# Altium project secret-25.PrjPcb
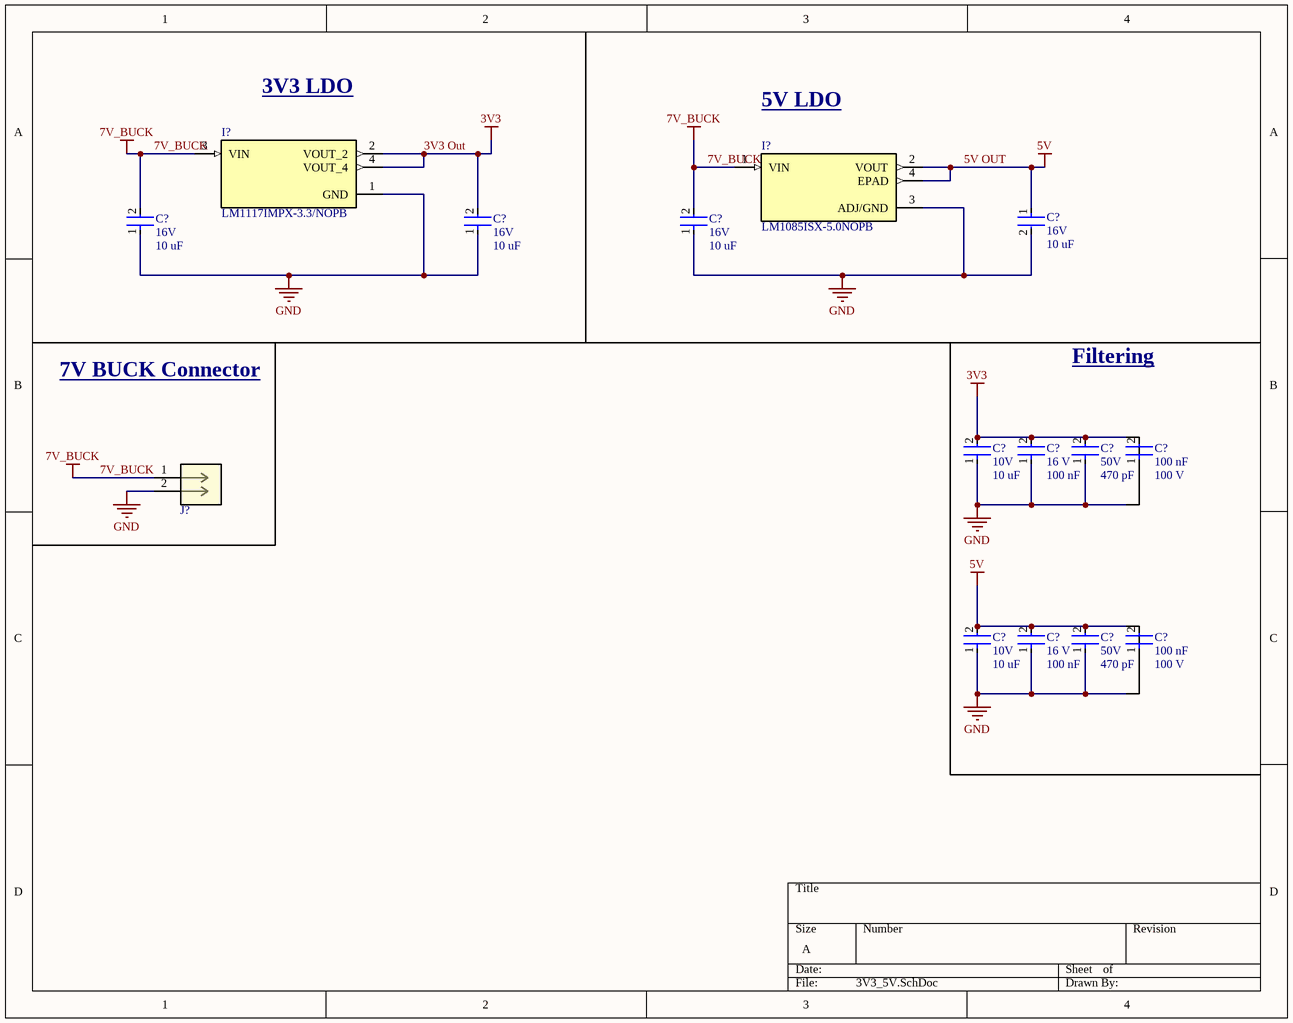
[diagram p0: 3V3_5V.SchDoc]
4 sheets, 44 parts. Net scope: flat (ports and power ports of the same name join across sheets).
Sheets:
  3V3_5V.SchDoc
  CAN.SchDoc
  Input_power.SchDoc
  MCU.SchDoc

## Sheet 3V3_5V.SchDoc
size A; SheetNumber: 1; SheetTotal: 4

### Parts
(Parts that share a designator on the sheet are numbered #1, #2 ... from top to bottom, then left to right.)
C?#1  Voltage: 16V  Capacitance: 10 uF  [CAP-1206]  (hidden comment: 293D106X9016A2TE3)
C?#2  Voltage: 16V  Capacitance: 10 uF  [CAP-1206]  (hidden comment: 293D106X9016A2TE3)
C?#3  Voltage: 16V  Capacitance: 10 uF  [CAP-1206]  (hidden comment: 293D106X9016A2TE3)
C?#4  Voltage: 16V  Capacitance: 10 uF  [CAP-1206]  (hidden comment: 293D106X9016A2TE3)
C?#5  Voltage: 10V  Capacitance: 10 uF  [CAP-0603]  (hidden comment: CC0603KRX5R6BB106)
C?#6  Voltage Rating: 16 V  Capacitance: 100 nF  [CAP-0402]  (hidden comment: CC0402KRX7R7BB104)
C?#7  Voltage: 50V  Capacitance: 470 pF  [CAP-0805]  (hidden comment: CC0805JRNPO9BN471)
C?#8  Capacitance: 100 nF  Voltage: 100 V  [CAP-0603]  (hidden comment: CC0603KRX7R0BB104)
C?#9  Voltage: 10V  Capacitance: 10 uF  [CAP-0603]  (hidden comment: CC0603KRX5R6BB106)
C?#10  Voltage Rating: 16 V  Capacitance: 100 nF  [CAP-0402]  (hidden comment: CC0402KRX7R7BB104)
C?#11  Voltage: 50V  Capacitance: 470 pF  [CAP-0805]  (hidden comment: CC0805JRNPO9BN471)
C?#12  Capacitance: 100 nF  Voltage: 100 V  [CAP-0603]  (hidden comment: CC0603KRX7R0BB104)
I?#1  LM1117IMPX-3.3/NOPB  [IC-SOT-223-4]
I?#2  LM1085ISX-5.0NOPB  [IC-TO-263-4]
J?  0430450212  [CON_430450212_MOL]  (value not drawn)

### Nets
3V3 Out: C?#3.2 C?#5.2 C?#6.2 C?#7.2 I?#1.2(VOUT_2) I?#1.4(VOUT_4)  [also labelled 3V3]
5V OUT: C?#1.1 C?#9.2 C?#10.2 C?#11.2 I?#2.2(VOUT) I?#2.4(EPAD)  [also labelled 5V]
7V_BUCK: C?#2.2 C?#4.2 I?#1.3(VIN) I?#2.1(VIN) J?.1
GND: C?#1.2 C?#2.1 C?#3.1 C?#4.1 C?#5.1 C?#6.1 C?#7.1 C?#9.1 C?#10.1 C?#11.1 I?#1.1(GND) I?#2.3(ADJ/GND) J?.2

Not connected (* = marked no-connect by the designer): C?#8 1 2; C?#12 1 2

### Notes on the sheet
- 3V3 LDO
- 5V LDO
- Filtering
- 7V BUCK Connector

### Library data of the parts
C?#1-C?#4 = CAP-10U-0004: CAP TANT 10UF 10% 16V 1206; Device Class: Tantalum; Size: 1206; ComponentLink1Description: Datasheet; ComponentLink1URL: https://www.lcsc.com/datasheet/lcsc_datasheet_2304140030_Vishay-Intertech-293D106X9016A2TE3_C110038.pdf
C?#5 C?#9 = CAP-10U-0001: CAP CER 10UF 10V X5R 0603; ComponentLink1Description: Datasheet; ComponentLink1URL: https://www.yageo.com/upload/media/product/app/datasheet/mlcc/upy-gphc_x5r_4v-to-50v.pdf; Device Class: Ceramic; Size: 0603
C?#6 C?#10 = CAP-0.1U-0001: CAP CER 0.1UF 16V X7R 0402; ComponentLink2Description: Datasheet; ComponentLink2URL: https://www.yageo.com/upload/media/product/productsearch/datasheet/mlcc/UPY-GPHC_X7R_6.3V-to-250V_24.pdf; Device Class: Ceramic; Size: 0402
C?#7 C?#11 = CAP-470P-0001: CAP CER 470PF 50V C0G/NPO 0805; Device Class: Ceramic; Size: 0805; ComponentLink1Description: Datasheet; ComponentLink1URL: https://www.yageo.com/upload/media/product/productsearch/datasheet/mlcc/UPY-GP_NP0_16V-to-50V_18.pdf
C?#8 C?#12 = CAP-100N-0001: CAP CER 0.1UF 100V X7R 0603; Device Class: Ceramic; Size: 0603; ComponentLink1Description: Datasheet; ComponentLink1URL: https://www.yageo.com/upload/media/product/app/datasheet/mlcc/upy-np0x7r_mv_100-to-630v.pdf
I?#1 = IC_LDO_3V3_0001: IC REG LIN 3.3V 800MA SOT223-4; ComponentLink1Description: New link; ComponentLink1URL: https://www.ti.com/lit/ds/symlink/lm1117.pdf?HQS=dis-dk-null-digikeymode-dsf-pf-null-wwe&ts=1721700739746
I?#2 = IC_LDO_5V_0002: IC REG LIN 5V 3A DDPAK/TO263-3; Mfr_Name: Texas Instruments; RefDes: RefDes; Type: Type; ComponentLink1Description: Datasheet; ComponentLink1URL: https://www.ti.com/lit/ds/symlink/lm1085.pdf?HQS=dis-dk-null-digikeymode-dsf-pf-null-wwe&ts=1729859809163&ref_url=https%253A%252F%252Fwww.ti.com%252Fgeneral%252Fdocs%252Fsuppproductinfo.tsp%253FdistId%253D10%2526gotoUrl%253Dhttps%253A%252F%252Fwww.ti.com%252Flit%252Fgpn%252Flm1085
J? = CONN-2POS-0001: Connector Header Through Hole 2 position; Mfr_Name: Molex Connector Corporation; RefDes: RefDes; Type: Type

## Sheet CAN.SchDoc
size A; SheetNumber: 3; SheetTotal: 6
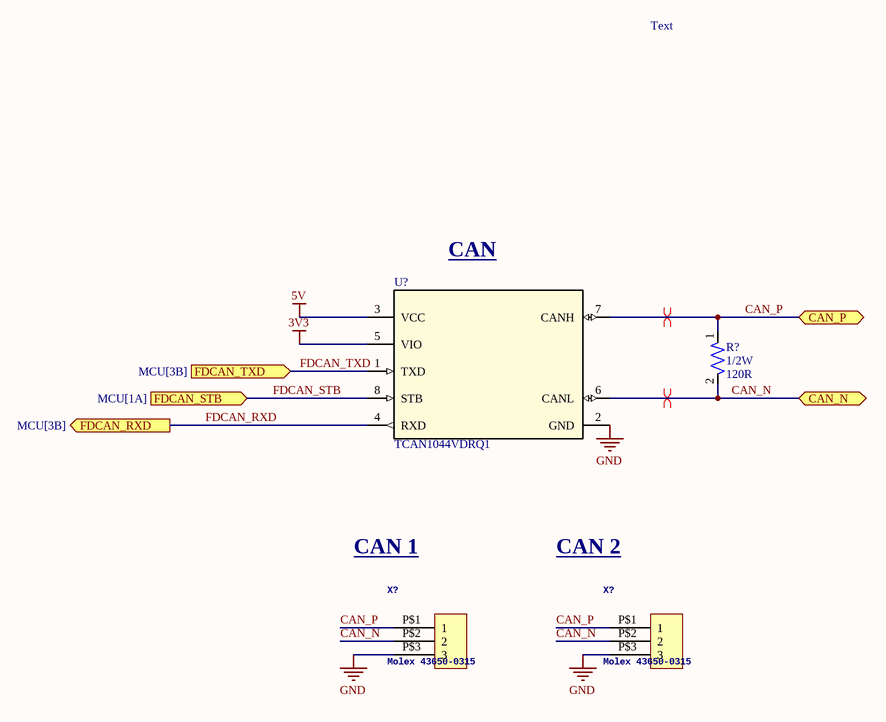
[diagram p1: CAN.SchDoc]

### Parts
(Parts that share a designator on the sheet are numbered #1, #2 ... from top to bottom, then left to right.)
R?  Power: 1/2W  Resistance: 120R  [RES-1210]  (hidden comment: RC1210FR-07120RL)
U?#1  TCAN1044VDRQ1  [IC-8SOIC]
X?#1  Molex 43650-0315  [43650-0315]
X?#2  Molex 43650-0315  [43650-0315]

### Ports
CAN_N (bidir), CAN_P (bidir), FDCAN_RXD (out, see MCU[3B]), FDCAN_STB (in, see MCU[1A]), FDCAN_TXD (in, see MCU[3B])

### Nets
3V3: U?#1.5(VIO)  [project net 3V3 Out]
5V: U?#1.3(VCC)  [project net 5V OUT]
GND: U?#1.2(GND) X?#1.P$3(3) X?#2.P$3(3)
CAN_N: R?.2 U?#1.6(CANL) X?#1.P$2(2) X?#2.P$2(2) ; port CAN_N
CAN_P: R?.1 U?#1.7(CANH) X?#1.P$1(1) X?#2.P$1(1) ; port CAN_P
FDCAN_RXD: U?#1.4(RXD) ; port FDCAN_RXD
FDCAN_STB: U?#1.8(STB) ; port FDCAN_STB
FDCAN_TXD: U?#1.1(TXD) ; port FDCAN_TXD

### Layout directives
differential pair: CAN_N, CAN_P

### Notes on the sheet
- Text
- CAN
- CAN 1
- CAN 2

### Library data of the parts
R? = RES-120-0001: RES 120 OHM 1% 1/2W 1210; Tolerance: 1%; Size: 1210; ComponentLink1Description: Datasheet; ComponentLink1URL: https://www.yageo.com/upload/media/product/products/datasheet/rchip/PYu-RC_Group_51_RoHS_L_12.pdf
U?#1 = IC-CAN-0001: IC TRANSCEIVER 1/1 8SOIC; ComponentLink1Description: Datasheet; ComponentLink1URL: https://www.ti.com/lit/ds/symlink/tcan1044-q1.pdf?HQS=dis-dk-null-digikeymode-dsf-pf-null-wwe&ts=1728758303289&ref_url=https%253A%252F%252Fwww.ti.com%252Fgeneral%252Fdocs%252Fsuppproductinfo.tsp%253FdistId%253D10%2526gotoUrl%253Dhttps%253A%252F%252Fwww.ti.com%252Flit%252Fgpn%252Ftcan1044-q1
X?#1 X?#2 = Micro-Fit Molex 3 Pin Vertical: GateName_1: G$1; SymbolName_1: HEADER_POS3; DeviceSetName: HEADER_POS3_?; DeviceName: 43650-0315; LibraryName: con-molex-micro-fit-3_0_2; Package: 43650-0315

## Sheet Input_power.SchDoc
size A; SheetNumber: 4; SheetTotal: 5
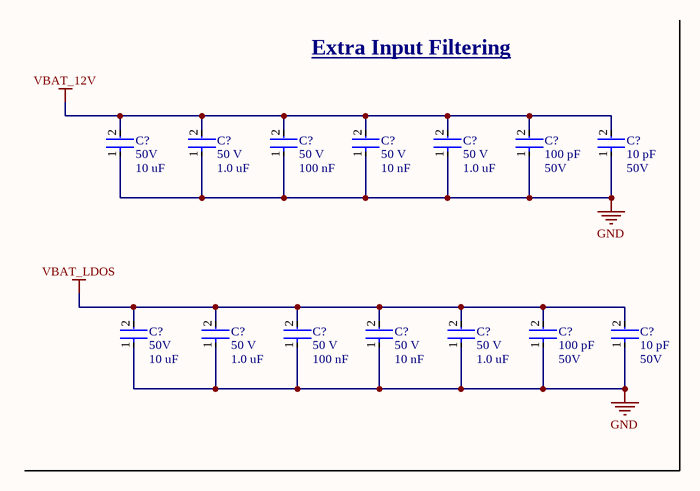
[diagram p2: Input_power.SchDoc]

### Parts
(Parts that share a designator on the sheet are numbered #1, #2 ... from top to bottom, then left to right.)
C?#13  Voltage: 50V  Capacitance: 10 uF  [CAP-1210]  (hidden comment: CL32B106KBJNNNE)
C?#14  Voltage: 50 V  Capacitance: 1.0 uF  [CAP-0805]  (hidden comment: CC0805KKX7R9BB105)
C?#15  Voltage Rating: 50 V  Capacitance: 100 nF  [CAP-0805]  (hidden comment: CC0805KRX7R9BB104)
C?#16  Voltage: 50 V  Capacitance: 10 nF  [CAP-0603]  (hidden comment: CC0603KPX7R9BB103)
C?#17  Voltage: 50 V  Capacitance: 1.0 uF  [CAP-0805]  (hidden comment: CC0805KKX7R9BB105)
C?#18  Capacitance: 100 pF  Voltage: 50V  [CAP-0402]  (hidden comment: CC0402JRNPO9BN101)
C?#19  Capacitance: 10 pF  Voltage: 50V  [CAP-0402]  (hidden comment: CC0402JRNPO9BN100)
C?#20  Voltage: 50V  Capacitance: 10 uF  [CAP-1210]  (hidden comment: CL32B106KBJNNNE)
C?#21  Voltage: 50 V  Capacitance: 1.0 uF  [CAP-0805]  (hidden comment: CC0805KKX7R9BB105)
C?#22  Voltage Rating: 50 V  Capacitance: 100 nF  [CAP-0805]  (hidden comment: CC0805KRX7R9BB104)
C?#23  Voltage: 50 V  Capacitance: 10 nF  [CAP-0603]  (hidden comment: CC0603KPX7R9BB103)
C?#24  Voltage: 50 V  Capacitance: 1.0 uF  [CAP-0805]  (hidden comment: CC0805KKX7R9BB105)
C?#25  Capacitance: 100 pF  Voltage: 50V  [CAP-0402]  (hidden comment: CC0402JRNPO9BN101)
C?#26  Capacitance: 10 pF  Voltage: 50V  [CAP-0402]  (hidden comment: CC0402JRNPO9BN100)

### Nets
GND: C?#13.1 C?#14.1 C?#15.1 C?#16.1 C?#17.1 C?#18.1 C?#19.1 C?#20.1 C?#21.1 C?#22.1 C?#23.1 C?#24.1 C?#25.1 C?#26.1
VBAT_12V: C?#13.2 C?#14.2 C?#15.2 C?#16.2 C?#17.2 C?#18.2 C?#19.2
VBAT_LDOS: C?#20.2 C?#21.2 C?#22.2 C?#23.2 C?#24.2 C?#25.2 C?#26.2

### Notes on the sheet
- Extra Input Filtering

### Library data of the parts
C?#13 C?#20 = CAP-10U-0002: CAP CER 10UF 50V X7R 1210; Device Class: Ceramic; Size: 1210; ComponentLink1Description: Datasheet; ComponentLink1URL: https://mm.digikey.com/Volume0/opasdata/d220001/medias/docus/41/CL32B106KBJNNNE_Spec.pdf
C?#14 C?#17 C?#21 C?#24 = CAP-1U-0001: CAP CER 1UF 50V X7R 0805; ComponentLink2URL: https://www.yageo.com/upload/media/product/productsearch/datasheet/mlcc/UPY-GPHC_X7R_6.3V-to-250V_24.pdf; ComponentLink2Description: Datasheet; Device Class: Ceramic; Size: 0805
C?#15 C?#22 = CAP-0.1U-0002: CAP CER 0.1UF 50V X7R 0805; ComponentLink2Description: Datasheet; ComponentLink2URL: https://www.yageo.com/upload/media/product/productsearch/datasheet/mlcc/UPY-GPHC_X7R_6.3V-to-250V_24.pdf; Device Class: Ceramic; Size: 0805
C?#16 C?#23 = CAP-10N-0002: CAP CER 10000PF 50V X7R 0603; ComponentLink2Description: Datasheet; ComponentLink2URL: http://www.yageo.com/documents/recent/UPY-GPHC_X7R_6.3V-to-50V_18.pdf; Device Class: Ceramic; Size: 0603
C?#18 C?#25 = CAP-100P-0001: CAP CER 100PF 50V C0G/NPO 0402; Device Class: Ceramic; Size: 0402; ComponentLink1Description: Datasheet; ComponentLink1URL: https://www.yageo.com/upload/media/product/productsearch/datasheet/mlcc/UPY-GP_NP0_16V-to-50V_18.pdf
C?#19 C?#26 = CAP-10P-0001: CAP CER 10PF 50V C0G/NPO 0402; Device Class: Ceramic; Size: 0402; ComponentLink1Description: Datasheet; ComponentLink1URL: https://www.yageo.com/upload/media/product/productsearch/datasheet/mlcc/UPY-GP_NP0_16V-to-50V_18.pdf

## Sheet MCU.SchDoc
size A; SheetNumber: 6; SheetTotal: 6
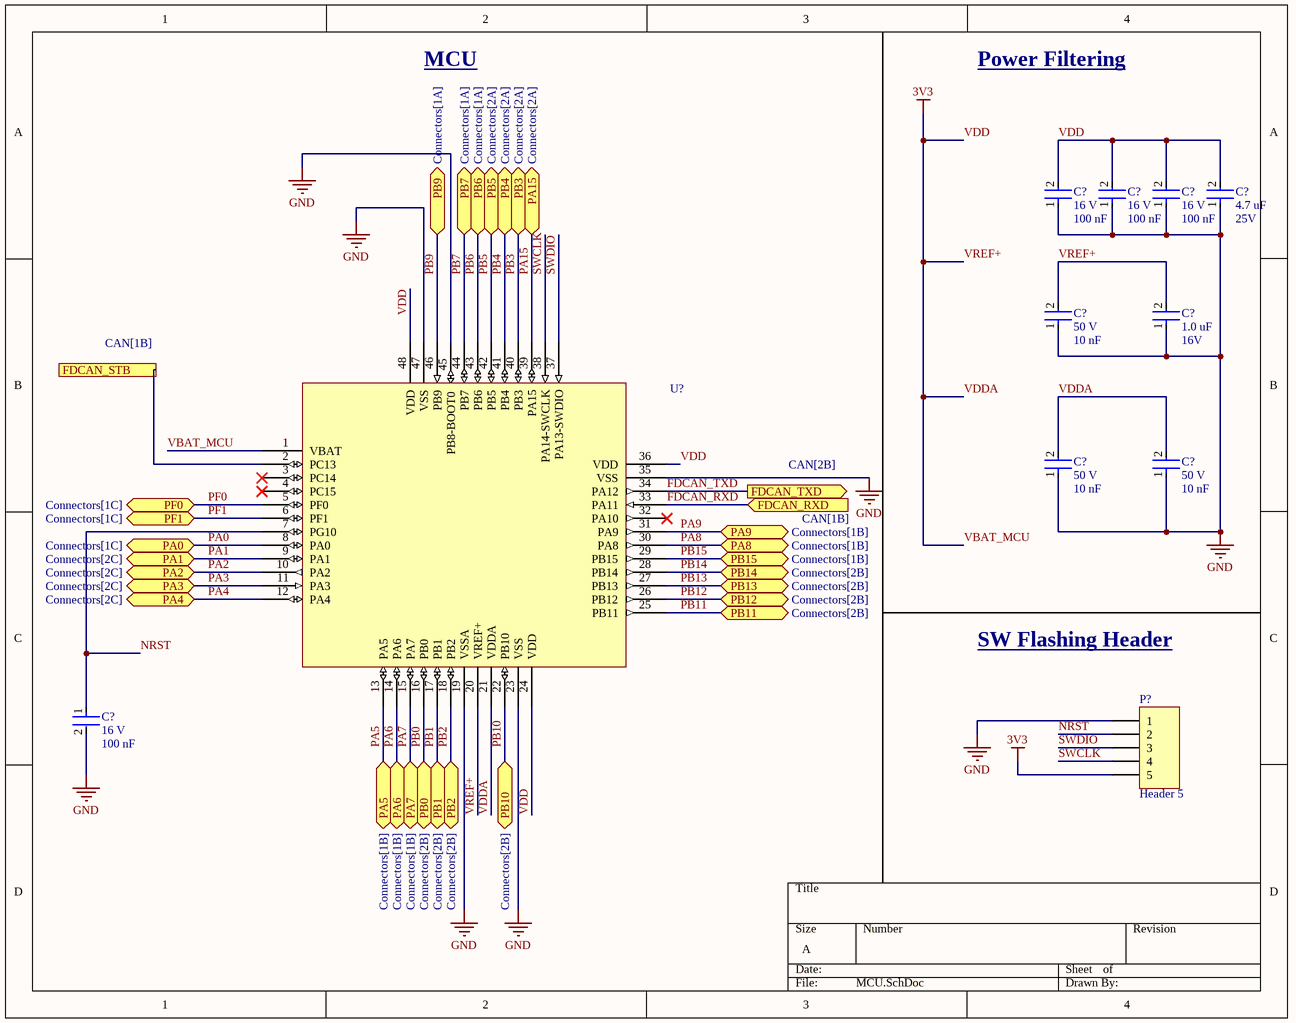
[diagram p3: MCU.SchDoc]

### Parts
(Parts that share a designator on the sheet are numbered #1, #2 ... from top to bottom, then left to right.)
C?#27  Voltage Rating: 16 V  Capacitance: 100 nF  [CAP-0402]  (hidden comment: CC0402KRX7R7BB104)
C?#28  Voltage Rating: 16 V  Capacitance: 100 nF  [CAP-0402]  (hidden comment: CC0402KRX7R7BB104)
C?#29  Voltage Rating: 16 V  Capacitance: 100 nF  [CAP-0402]  (hidden comment: CC0402KRX7R7BB104)
C?#30  Capacitance: 4.7 uF  Voltage: 25V  [CAP-0603]  (hidden comment: CC0603KRX5R8BB475)
C?#31  Voltage: 50 V  Capacitance: 10 nF  [CAP-0603]  (hidden comment: CC0603KPX7R9BB103)
C?#32  Capacitance: 1.0 uF  Voltage: 16V  [CAP-0603]  (hidden comment: CC0603KRX7R7BB105)
C?#33  Voltage: 50 V  Capacitance: 10 nF  [CAP-0603]  (hidden comment: CC0603KPX7R9BB103)
C?#34  Voltage: 50 V  Capacitance: 10 nF  [CAP-0603]  (hidden comment: CC0603KPX7R9BB103)
C?#35  Voltage Rating: 16 V  Capacitance: 100 nF  [CAP-0402]  (hidden comment: CC0402KRX7R7BB104)
P?  Header 5  [HDR1X5]
U?#2  STM32G431CBT6  [IC-LQFP48]  (value not drawn)

### Ports
FDCAN_RXD (in, see CAN[1B]), FDCAN_STB (see CAN[1B]), FDCAN_TXD (out, see CAN[2B]), PA0 (bidir, see Connectors[1C]), PA1 (bidir, see Connectors[2C]), PA2 (bidir, see Connectors[2C]), PA3 (bidir, see Connectors[2C]), PA4 (bidir, see Connectors[2C]), PA5 (bidir, see Connectors[1B]), PA6 (bidir, see Connectors[1B]), PA7 (bidir, see Connectors[1B]), PA8 (bidir, see Connectors[1B]), PA9 (bidir, see Connectors[1B]), PA15 (bidir, see Connectors[2A]), PB0 (bidir, see Connectors[2B]), PB1 (bidir, see Connectors[2B]), PB2 (bidir, see Connectors[2B]), PB3 (bidir, see Connectors[2A]), PB4 (bidir, see Connectors[2A]), PB5 (bidir, see Connectors[2A]), PB6 (bidir, see Connectors[1A]), PB7 (bidir, see Connectors[1A]), PB9 (bidir, see Connectors[1A]), PB10 (bidir, see Connectors[2B]), PB11 (bidir, see Connectors[2B]), PB12 (bidir, see Connectors[2B]), PB13 (bidir, see Connectors[2B]), PB14 (bidir, see Connectors[2B]), PB15 (bidir, see Connectors[1B]), PF0 (bidir, see Connectors[1C]), PF1 (bidir, see Connectors[1C])

### Nets
3V3: C?#27.2 C?#28.2 C?#29.2 C?#30.2 C?#31.2 C?#32.2 C?#33.2 C?#34.2 P?.5 U?#2.1(VBAT) U?#2.20(VREF+) U?#2.21(VDDA) U?#2.24(VDD) U?#2.36(VDD) U?#2.48(VDD)  [also labelled VBAT_MCU, VDD, VDDA, VREF+]  [project net 3V3 Out]
GND: C?#27.1 C?#28.1 C?#29.1 C?#30.1 C?#31.1 C?#32.1 C?#33.1 C?#34.1 C?#35.2 P?.1 U?#2.19(VSSA) U?#2.23(VSS) U?#2.35(VSS) U?#2.45(PB8-BOOT0) U?#2.47(VSS)
FDCAN_RXD: U?#2.33(PA11) ; port FDCAN_RXD
FDCAN_STB: U?#2.2(PC13) ; port FDCAN_STB
FDCAN_TXD: U?#2.34(PA12) ; port FDCAN_TXD
NRST: C?#35.1 P?.2 U?#2.7(PG10)
PA0: U?#2.8(PA0) ; port PA0
PA1: U?#2.9(PA1) ; port PA1
PA2: U?#2.10(PA2) ; port PA2
PA3: U?#2.11(PA3) ; port PA3
PA4: U?#2.12(PA4) ; port PA4
PA5: U?#2.13(PA5) ; port PA5
PA6: U?#2.14(PA6) ; port PA6
PA7: U?#2.15(PA7) ; port PA7
PA8: U?#2.30(PA8) ; port PA8
PA9: U?#2.31(PA9) ; port PA9
PA15: U?#2.39(PA15) ; port PA15
PB0: U?#2.16(PB0) ; port PB0
PB1: U?#2.17(PB1) ; port PB1
PB2: U?#2.18(PB2) ; port PB2
PB3: U?#2.40(PB3) ; port PB3
PB4: U?#2.41(PB4) ; port PB4
PB5: U?#2.42(PB5) ; port PB5
PB6: U?#2.43(PB6) ; port PB6
PB7: U?#2.44(PB7) ; port PB7
PB9: U?#2.46(PB9) ; port PB9
PB10: U?#2.22(PB10) ; port PB10
PB11: U?#2.25(PB11) ; port PB11
PB12: U?#2.26(PB12) ; port PB12
PB13: U?#2.27(PB13) ; port PB13
PB14: U?#2.28(PB14) ; port PB14
PB15: U?#2.29(PB15) ; port PB15
PF0: U?#2.5(PF0) ; port PF0
PF1: U?#2.6(PF1) ; port PF1
SWCLK: P?.4 U?#2.38(PA14-SWCLK)
SWDIO: P?.3 U?#2.37(PA13-SWDIO)

Not connected (* = marked no-connect by the designer): U?#2 3(PC14)* 4(PC15)* 32(PA10)*

### Notes on the sheet
- MCU
- Power Filtering
- SW Flashing Header

### Library data of the parts
C?#27-C?#29 C?#35 = CAP-0.1U-0001: CAP CER 0.1UF 16V X7R 0402; ComponentLink2Description: Datasheet; ComponentLink2URL: https://www.yageo.com/upload/media/product/productsearch/datasheet/mlcc/UPY-GPHC_X7R_6.3V-to-250V_24.pdf; Device Class: Ceramic; Size: 0402
C?#30 = CAP-4.7U-0001: CAP CER 4.7UF 25V X5R 0603; Device Class: Ceramic; Size: 0603
C?#31 C?#33 C?#34 = CAP-10N-0002: CAP CER 10000PF 50V X7R 0603; ComponentLink2Description: Datasheet; ComponentLink2URL: http://www.yageo.com/documents/recent/UPY-GPHC_X7R_6.3V-to-50V_18.pdf; Device Class: Ceramic; Size: 0603
C?#32 = CAP-1U-0002: CAP CER 1UF 16V X7R 0603; Device Class: Ceramic; Size: 0603
P? = Header 5: Header, 5-Pin; LatestRevisionDate: 17-Jul-2002; LatestRevisionNote: Re-released for DXP Platform.; Publisher: Altium Limited
U?#2 = IC-STM32G431CBT6: IC MCU 32BIT 128KB FLASH 48LQFP; Package: 48LQFP; ComponentLink1Description: Datasheet; ComponentLink1URL: https://www.st.com/resource/en/datasheet/stm32g431cb.pdf

## Nets that join several sheets
3V3 Out: 3V3_5V (6 pins), CAN (U?#1.5), MCU (15 pins)
5V OUT: 3V3_5V (6 pins), CAN (U?#1.3)
GND: 3V3_5V (13 pins), CAN (U?#1.2 X?#1.P$3 X?#2.P$3), Input_power (14 pins), MCU (15 pins)
FDCAN_RXD: CAN (U?#1.4), MCU (U?#2.33)
FDCAN_STB: CAN (U?#1.8), MCU (U?#2.2)
FDCAN_TXD: CAN (U?#1.1), MCU (U?#2.34)